# EAGLE design sch (EAGLE 9.5.2)
Piny PA13(SWCLK) i PA14(SWDIO) mają być na odwrót (tak samo ich podłączenie)
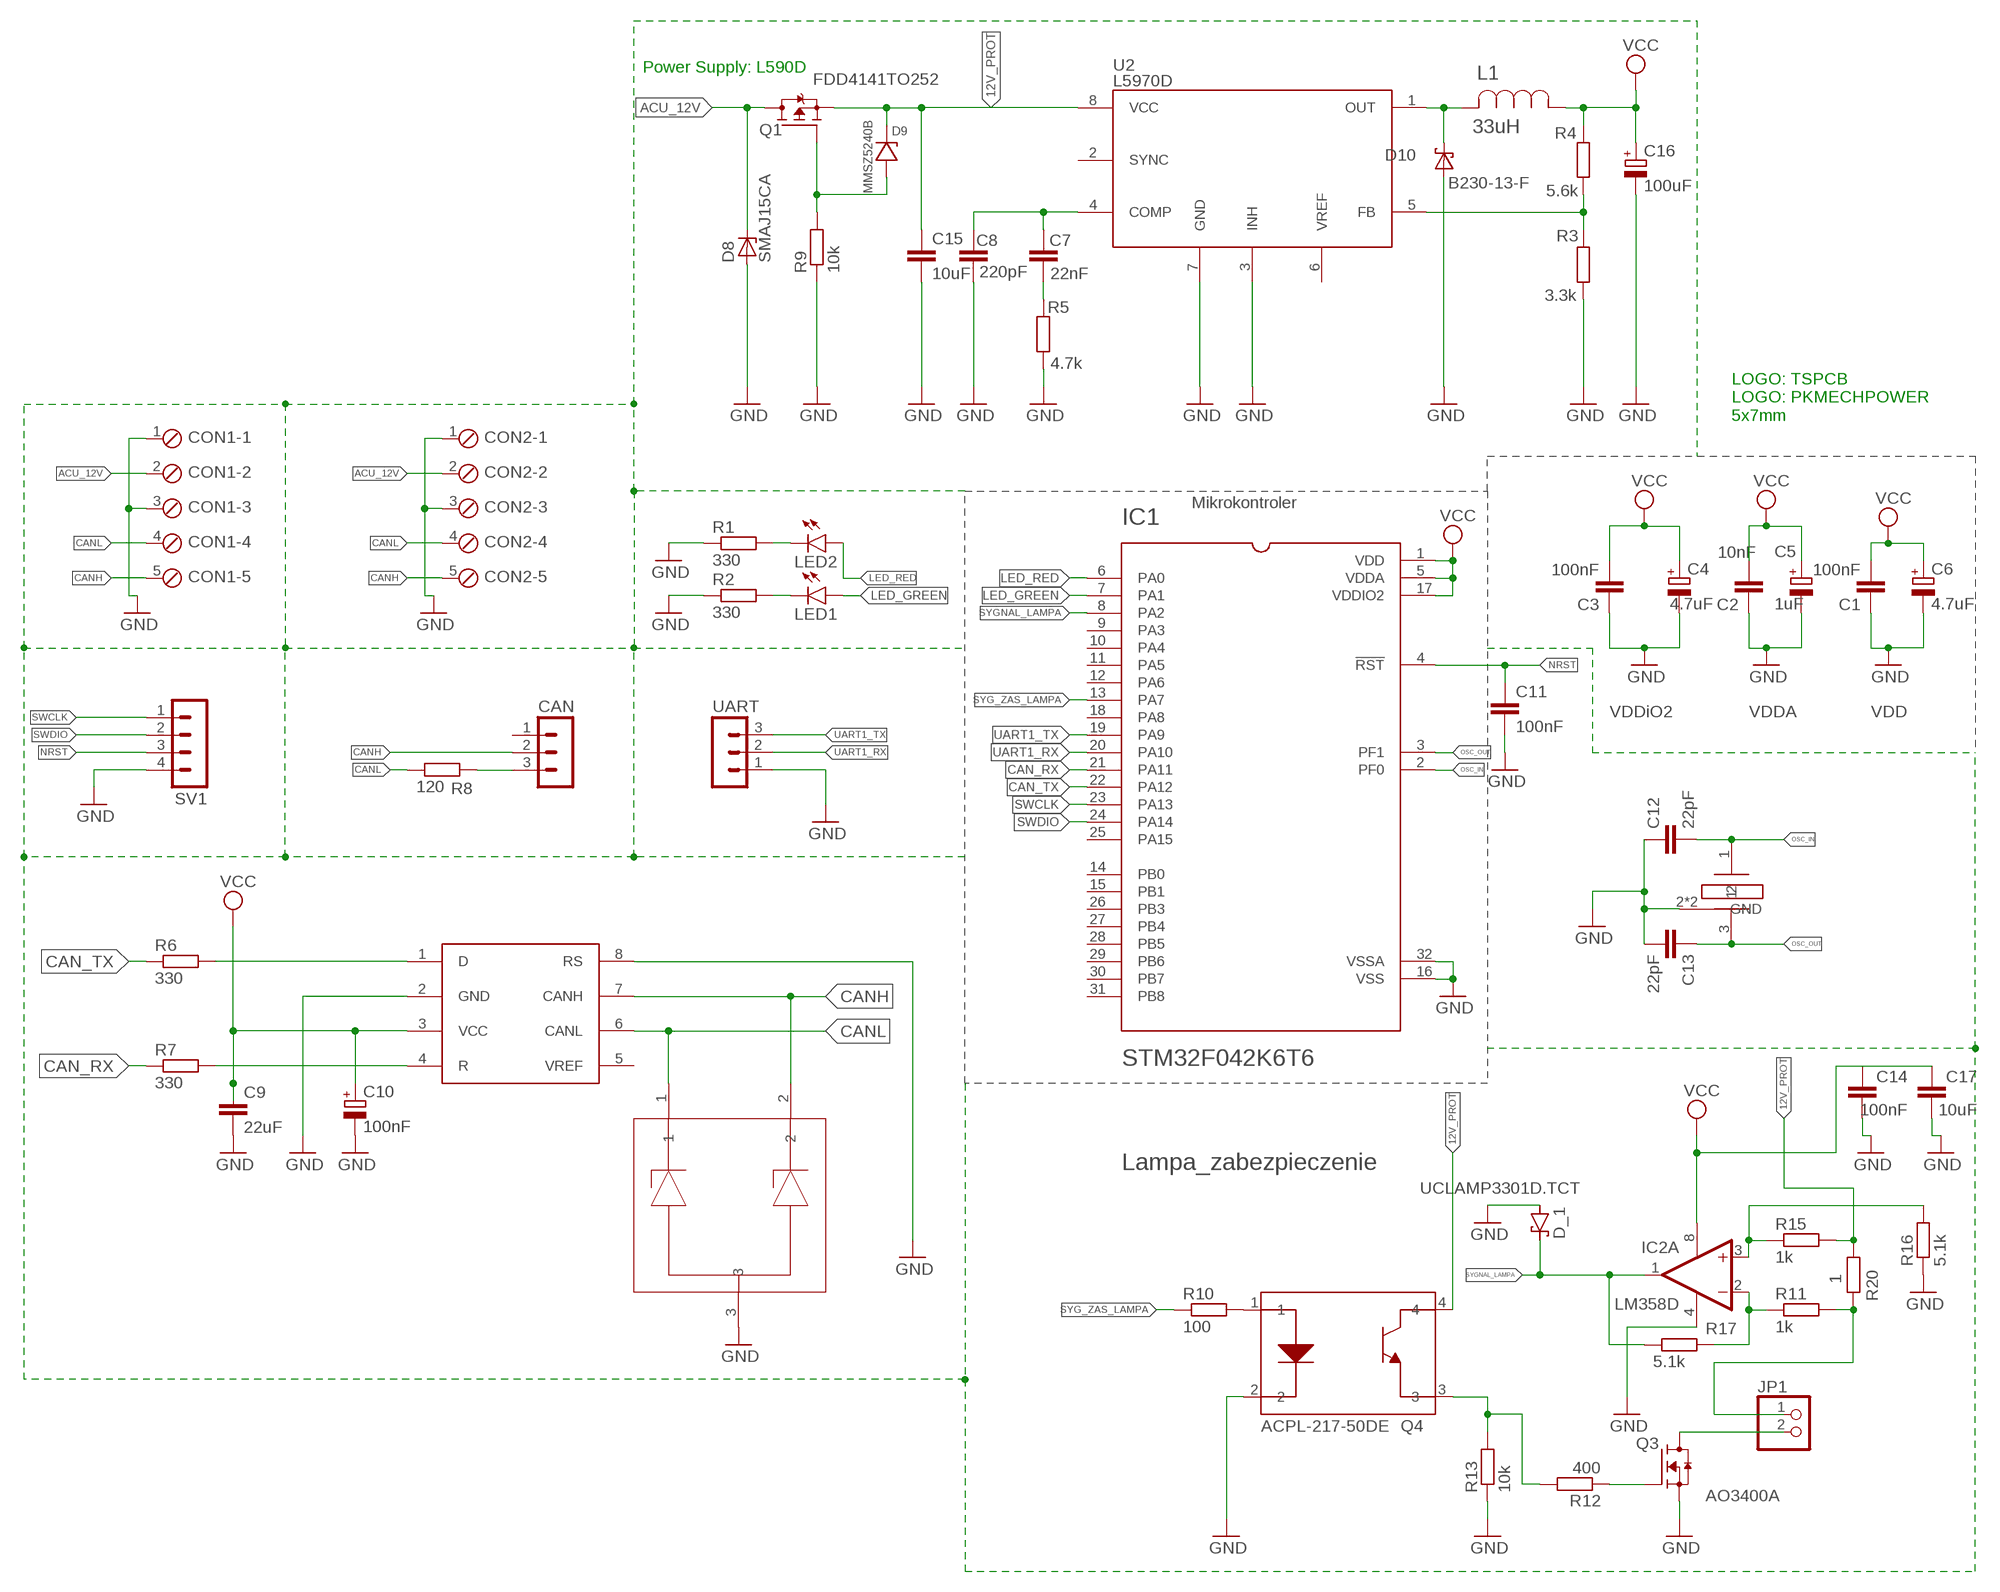
[diagram p0: schematic, sheet 1]

## Parts
C1  100nF  C-EUC0805  [C0805]
C2  10nF  C-EUC0805  [C0805]
C3  100nF  C-EUC0805  [C0805]
C4  4.7uF  CPOL-EUSMCC  [SMC_C]
C5  1uF  CPOL-EUSMCC  [SMC_C]
C6  4.7uF  CPOL-EUSMCC  [SMC_C]
C7  22nF  C-EUC0805  [C0805]
C8  220pF  C-EUC0805  [C0805]
C9  22uF  C-EUC0805  [C0805]
C10  100nF  CPOL-EUSMCC  [SMC_C]
C11  100nF  C-EUC0805  [C0805]
C12  22pF  C-EUC0805  [C0805]
C13  22pF  C-EUC0805  [C0805]
C14  100nF  C-EUC0805  [C0805]
C15  10uF  C-EUC1210  [C1210]
C16  100uF  CPOL-EUSMCD  [SMC_D]
C17  10uF  C-EUC0805  [C0805]
CAN  MA03-1  [MA03-1]
CON1  MPT5  [5POL254]
CON2  MPT5  [5POL254]
D8  SMAJ15CA  [SMA]
D9  MMSZ5240B  ZENER_01  [SOD123]
D10  B230-13-F  [SMB]
D_1  UCLAMP3301D.TCT  [SOD323]
IC1  STM32F042K6T6  [QFP80P900X900X160-32N]
IC2  LM358D  [SO08]
JP1  PINHD-1X2  [1X02]
L1  33uH  DR125-680-R  [INDM125125X600N]
LED1  LEDCHIP-LED0805  [CHIP-LED0805]
LED2  LEDCHIP-LED0805  [CHIP-LED0805]
Q1  FDD4141TO252  [TO252]
Q3  AO3400A  [SOT95P280X125-3N]
Q4  ACPL-217-50DE  [SOIC127P700X220-4N]
R1  330  R-EU_R0805  [R0805]
R2  330  R-EU_R0805  [R0805]
R3  3.3k  R-EU_R0805  [R0805]
R4  5.6k  R-EU_R0805  [R0805]
R5  4.7k  R-EU_R0805  [R0805]
R6  330  R-EU_M0805  [M0805]
R7  330  R-EU_M0805  [M0805]
R8  120  R-EU_M0805  [M0805]
R9  10k  R-EU_R0805  [R0805]
R10  100  R-EU_M0805  [M0805]
R11  1k  R-EU_M0805  [M0805]
R12  400  R-EU_M0805  [M0805]
R13  10k  R-EU_M0805  [M0805]
R15  1k  R-EU_M0805  [M0805]
R16  5.1k  R-EU_M0805  [M0805]
R17  5.1k  R-EU_M0805  [M0805]
R20  1  R-EU_R2512  [R2512]
SV1  MA04-1  [MA04-1]
U2  L5970D  [SO-8]
U$1  SN65HVD  [SO8]
U$2  PESD3V3S2UT_  [SOT95P230X110-3N]
UART  MA03-1  [MA03-1]
XTAL1  CRYSTAL_SMDXT-324  [XT-324]

## Nets
12V_PROT: C15.1 D9.1 Q1.2(S) Q4.4 R15.2 R20.2 U2.8(VCC)
ACU_12V: CON1.2 CON2.2 D8.1(K) Q1.3(D)
CAN_RX: IC1.21(PA11) R7.1
CAN_TX: IC1.22(PA12) R6.1
CANH: CAN.2 CON1.5 CON2.5 U$1.7(CANH) U$2.2
CANL: CON1.4 CON2.4 R8.1 U$1.6(CANL) U$2.1
GND: C1.1 C2.1 C3.1 C4.- C5.- C6.- C8.1 C9.2 C10.- C11.2 C12.1 C13.2 C14.1 C15.2 C16.- C17.1 CON1.1 CON1.3 CON2.1 CON2.3 D8.2(A) D10.2(A) D_1.1(A) IC1.16(VSS) IC1.32(VSSA) IC2.4(P:V-) Q3.2(S) Q4.2 R1.1 R2.1 R3.1 R5.1 R9.1 R13.1 R16.1 SV1.4 U2.3(INH) U2.7(GND) U$1.2(GND) U$1.8(RS) U$2.3 UART.1 XTAL1.2(GND) XTAL1.4(GND)
LED_GREEN: IC1.7(PA1) LED1.A
LED_RED: IC1.6(PA0) LED2.A
N$1: R6.2 U$1.1(D)
N$2: R7.2 U$1.4(R)
N$3: LED2.C R1.2
N$4: LED1.C R2.2
N$5: JP1.2 Q3.3(D)
N$6: CAN.3 R8.2
N$7: D9.2 Q1.1(G) R9.2
N$9: IC2.3(A:+IN) R15.1 R16.2
N$10: Q4.1 R10.2
N$11: Q3.1(G) R12.1
N$13: D10.1(K) L1.2 U2.1(OUT)
N$14: Q4.3 R12.2 R13.2
N$15: R3.2 R4.1 U2.5(FB)
N$16: IC2.2(A:-IN) R11.1 R17.2
N$17: JP1.1 R11.2 R20.1
N$20: C7.2 C8.2 U2.4(COMP)
N$22: C7.1 R5.2
NRST: C11.1 IC1.4(!RST) SV1.3
OSC_IN: C12.2 IC1.2(PF0) XTAL1.1
OSC_OUT: C13.1 IC1.3(PF1) XTAL1.3
SWCLK: IC1.23(PA13) SV1.1
SWDIO: IC1.24(PA14) SV1.2
SYG_ZAS_LAMPA: IC1.13(PA7) R10.1
SYGNAL_LAMPA: D_1.2(C) IC1.8(PA2) IC2.1(A:OUT) R17.1
UART1_RX: IC1.20(PA10) UART.2
UART1_TX: IC1.19(PA9) UART.3
VCC: C1.2 C2.2 C3.2 C4.+ C5.+ C6.+ C9.1 C10.+ C14.2 C16.+ C17.2 IC1.1(VDD) IC1.5(VDDA) IC1.17(VDDIO2) IC2.8(P:V+) L1.1 R4.2 U$1.3(VCC)
Unconnected: CAN.1 IC1.9(PA3) IC1.10(PA4) IC1.11(PA5) IC1.12(PA6) IC1.14(PB0) IC1.15(PB1) IC1.18(PA8) IC1.25(PA15) IC1.26(PB3) IC1.27(PB4) IC1.28(PB5) IC1.29(PB6) IC1.30(PB7) IC1.31(PB8) IC2.5(B:+IN) IC2.6(B:-IN) IC2.7(B:OUT) U2.2(SYNC) U2.6(VREF) U$1.5(VREF)

## Notes on the sheet
- Power Supply: L590D
- LOGO: TSPCB
  LOGO: PKMECHPOWER
  5x7mm
- Mikrokontroler
- VDDiO2 | VDDA | VDD
- Lampa_zabezpieczenie

## Library data of the parts
C1-C3 C7-C9 C11-C15 C17 = rcl:C-EU: CAPACITOR, European symbol; SPICEPREFIX: C
C4-C6 C10 C16 = rcl:CPOL-EU: POLARIZED CAPACITOR, European symbol; SPICEPREFIX: C
CAN UART = con-lstb:MA03-1: PIN HEADER; OC_FARNELL: unknown; OC_NEWARK: unknown
CON1 CON2 = con-phoenix-254:MPT5: PHOENIX CONNECTOR; OC_FARNELL: unknown; OC_NEWARK: unknown
D8 = _SMAJ15CA:SMAJ15CA: Ultra low capacitance unidirectional ElectroStatic Discharge (ESD) protection diode in a SOD523 (SC-79) ultra small and flat lead Surface-Mounted Device (SMD) plastic package designed to protect one signal line from the damage caused by ESD and other transients. AAL Eindhoven MK; AVAILABILITY: Unavailable; DESCRIPTION: DIODE, ESD, LOW CAPACITANCE, SOD523; Diode Type: ESD Protection; Diode Case Style: SOD-523; No. of Pins: 2; MF: Nexperia USA; MP: PESD5V0X1UB; PACKAGE: SOD-523 NXP Semiconductors; PRICE: None
D9 = aLib_diode:ZENER_01
D10 = _B230-13-F:B230-13-F
D_1 = sp4020_10:UCLAMP3301D.TCT
IC1 = _STM32F042K6T6:STM32F042K6T6: Entry-level ARM Cortex-M0 MCU with 32 Kbytes Flash, 48 MHz CPU, USB, CAN and CEC functions; AVAILABILITY: Unavailable; DESCRIPTION: Entry-level ARM Cortex-M0 MCU with 32 Kbytes Flash, 48 MHz CPU, USB, CAN and CEC functions; MF: STMicroelectronics; MP: STM32F042K6T6; PACKAGE: LQFP-32 STMicroelectronics; PRICE: None
IC2 = LM358:LM358: OP AMP
JP1 = pinhead:PINHD-1X2: PIN HEADER
L1 = _DE1205-33:DR125-680-R: POWER INDUCTOR; AVAILABILITY: Unavailable; MF: Coilcraft; MP: DR125-680-R; PACKAGE: Nonstandard Coilcraft; PRICE: None
LED1 LED2 = led:LED: LED OSRAM: - CHIPLED LG R971, LG N971, LY N971, LG Q971, LY Q971, LO R971, LY R971 LH N974, LH R974 LS Q976, LO Q976, LY Q976 LO Q996 - Hyper CHIPLED LW Q18S LB Q993, LB Q99A, LB R99A - SideLED LS A670, LO A670, LY A670, LG A670, LP A670 LB A673, LV A673, LT A673, LW A673 LH A674 LY A675 LS A676, LA A676, LO A676, LY A676, LW A676 LS A679, LY A679, LG A679 - Hyper Micro SIDELED® LS Y876, LA Y876, LO Y876, LY Y876 LT Y87S - SmartLED LW L88C, LW L88S LB L89C, LB L89S, LG L890 LS L89K, LO L89K, LY L89K LS L896, LA L896, LO L896, LY L896 - TOPLED LS T670, LO T670, LY T670, LG T670, LP T670 LSG T670, LSP T670, LSY T670, LOP T670, LYG T670 LG T671, LOG T671, LSG T671 LB T673, LV T673, LT T673, LW T673 LH T674 LS T676, LA T676, LO T676, LY T676, LB T676, LH T676, LSB T676, LW T676 LB T67C, LV T67C, LT T67C, LS T67K, LO T67K, LY T67K, LW E67C LS E67B, LA E67B, LO E67B, LY E67B, LB E67C, LV E67C, LT E67C LW T67C LS T679, LY T679, LG T679 LS T770, LO T770, LY T770, LG T770, LP T770 LB T773, LV T773, LT T773, LW T773 LH T774 LS E675, LA E675, LY E675, LS T675 LS T776, LA T776, LO T776, LY T776, LB T776 LHGB T686 LT T68C, LB T68C - Hyper Mini TOPLED® LB M676 - Mini TOPLED Santana® LG M470 LS M47K, LO M47K, LY M47K Source: http://www.osram.convergy.de LUXEON: - LUMILED® LXK2-PW12-R00, LXK2-PW12-S00, LXK2-PW14-U00, LXK2-PW14-V00 LXK2-PM12-R00, LXK2-PM12-S00, LXK2-PM14-U00 LXK2-PE12-Q00, LXK2-PE12-R00, LXK2-PE12-S00, LXK2-PE14-T00, LXK2-PE14-U00 LXK2-PB12-K00, LXK2-PB12-L00, LXK2-PB12-M00, LXK2-PB14-N00, LXK2-PB14-P00, LXK2-PB14-Q00 LXK2-PR12-L00, LXK2-PR12-M00, LXK2-PR14-Q00, LXK2-PR14-R00 LXK2-PD12-Q00, LXK2-PD12-R00, LXK2-PD12-S00 LXK2-PH12-R00, LXK2-PH12-S00 LXK2-PL12-P00, LXK2-PL12-Q00, LXK2-PL12-R00 Source: www.luxeon.com KINGBRIGHT: KA-3528ASYC Source: www.kingbright.com
Q1 = transistor-fet:FDD4141: P-Channel PowerTrench® MOSFET Source: FDD4141.pdf
Q3 = AO3400A:AO3400A: Trans MOSFET N-CH 30V 5.7A 3-Pin SOT-23; ARROW_ELECTRONICS-PURCHASE-URL: https://snapeda.com/shop?store=Arrow+Electronics&id=405248; AVAILABILITY: Unavailable; DESCRIPTION: N-Channel 30V 5.7A (Ta) 1.4W (Ta) Surface Mount SOT-23-3L; DIGIKEY-PURCHASE-URL: https://snapeda.com/shop?store=DigiKey&id=405248; MF: Alpha &; MP: AO3400A; PACKAGE: SOT-23 Alpha &amp; Omega Semiconductor; PRICE: None
Q4 = _ACPL-217-50DE:ACPL-217-50DE: OPTOISOLATOR 3KV TRANSISTOR 4-SO; AVAILABILITY: Unavailable; DESCRIPTION: Transistor Output Optocouplers 3000Vrms 50% CTR; MF: Broadcom / Avago; MOUSER-PURCHASE-URL: https://snapeda.com/shop?store=Mouser&id=4793791; MP: ACPL-217-50DE; PACKAGE: None; PRICE: None
R1-R13 R15-R17 R20 = rcl:R-EU_: RESISTOR, European symbol; SPICEPREFIX: R
SV1 = con-lstb:MA04-1: PIN HEADER; OC_FARNELL: unknown; OC_NEWARK: unknown
U2 = _L5970D:L5970D; AVAILABILITY: Unavailable; DESCRIPTION: L5970D Series 36 V 1 A Step Down Monolithic Power Switching Regulator - SOIC-8; MF: STMicroelectronics; MP: L5970D; PACKAGE: SOIC-8 STMicroelectronics; PRICE: None
U$1 = SN65HVD230:SN65HVD
U$2 = _PESD3V3S2UT:PESD3V3S2UT_
XTAL1 = _crystals:CRYSTAL_SMD

## Board
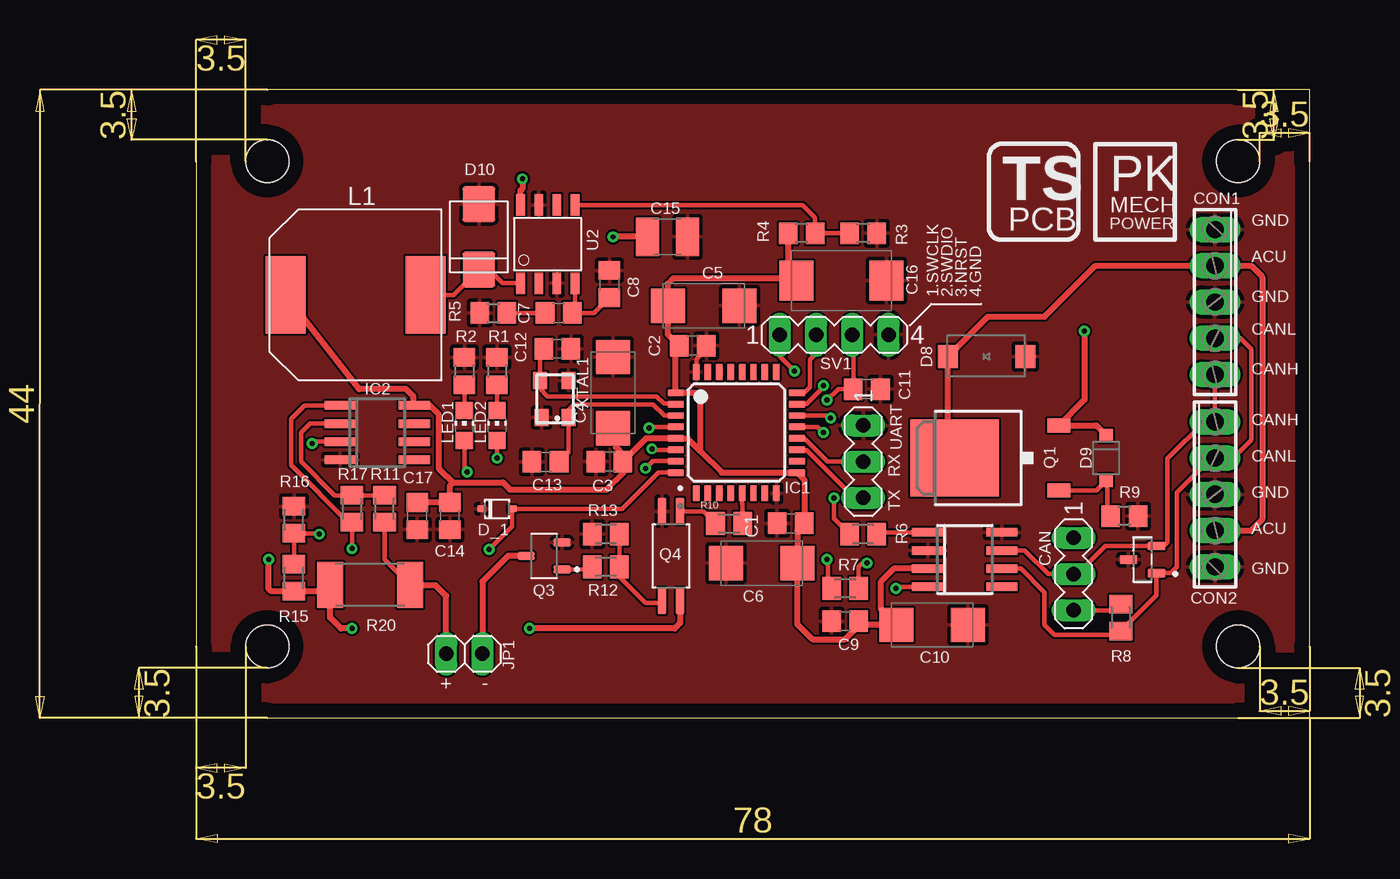
[diagram p1: board, top side]
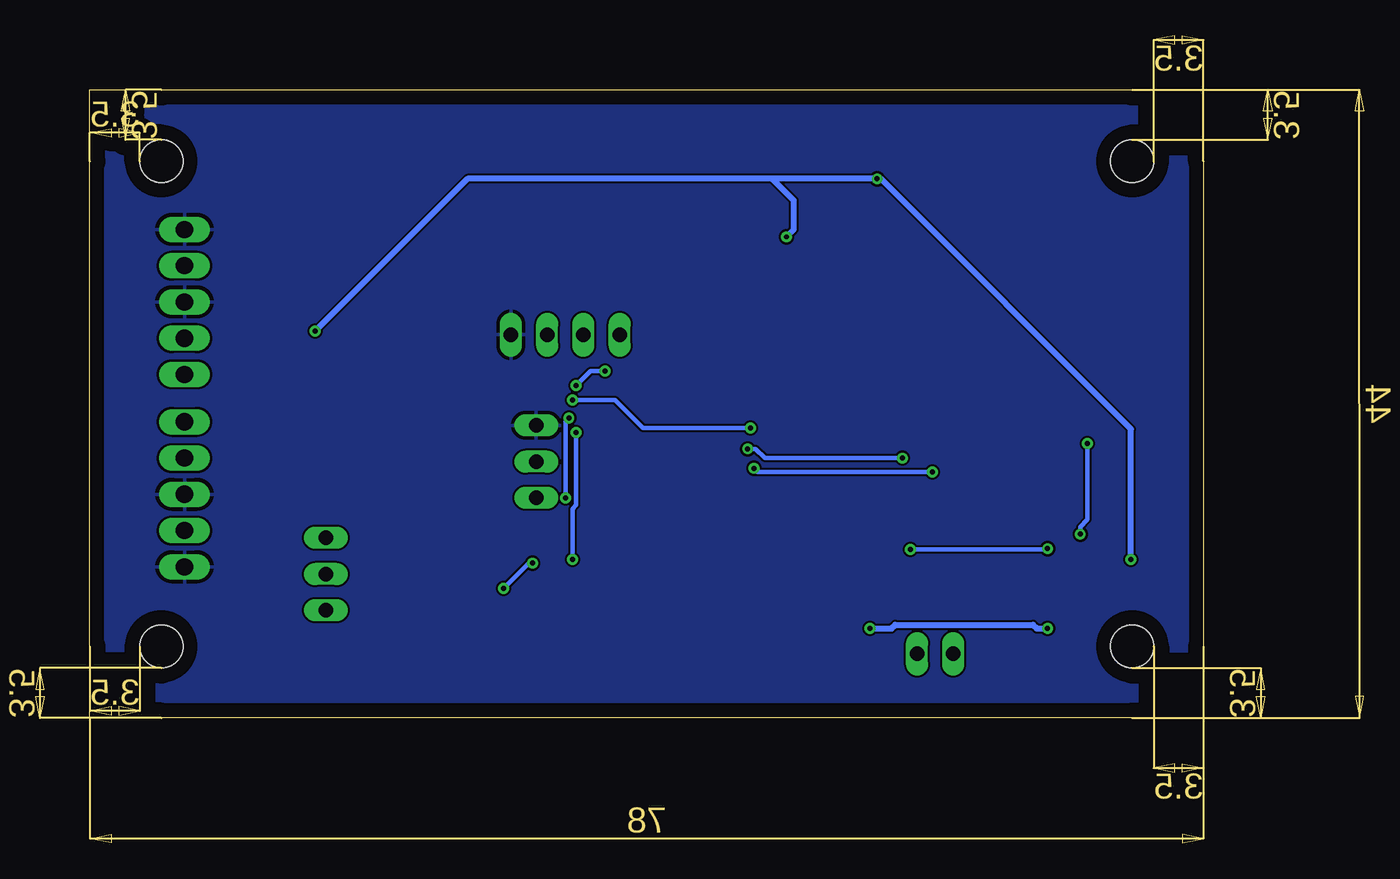
[diagram p2: board, bottom side, seen from below]

Size 78 x 44 mm. Coordinates in mm from the lower left corner, seen from the top.
Outline: 0,0 78,0 78,44 0,44 0,0
Copper layers (1*16): Top 0.035mm / dielectric 1.5mm / Bottom 0.035mm
Design rules "default *": minimum track width 12mil, minimum drill 0.35mm, track to track 6mil, track to pad 6mil, pad to pad 6mil, via to via 6mil, smd to smd 6mil, copper to edge 40mil, drill to drill 6mil, minimum pad ring 10mil, minimum via ring 8mil, stop-mask expansion 4mil, vias tented up to drill 0mil, thermal gap 10mil
Holes 3 mm at 5,5.02 5,39.02 73,39.02 73,5.02

### Footprints (pad centres in the part's own frame; a part is rotated, then mirrored left to right if it is on the bottom)
C0805 = smd 1.3 x 1.5: 1 -0.95,0; 2 0.95,0
SMC_C = smd 2.4 x 2.4: + -2.5,0; - 2.5,0
C1210 = smd 1.6 x 2.7: 1 -1.4,0; 2 1.4,0
SMC_D = smd 2.4 x 2.8: + -3.15,0; - 3.15,0
MA03-1 = drill 1.016 long: 1 -2.54,0; 2 0,0; 3 2.54,0
5POL254 = drill 1.2 long: 1 -5.08,0; 2 -2.54,0; 3 0,0; 4 2.54,0; 5 5.08,0
SMA = smd 1.4 x 1.64: 1 2.715,0; 2 -2.715,0
SOD123 = smd 0.95 x 0.9: 1 0,1.575; 2 0,-1.575
SMB = smd 2.5 x 2.3: 1 -2.3,0; 2 2.3,0
SOD323 = smd 0.6 x 0.45: 1 -1.06,0; 2 1.06,0
QFP80P900X900X160-32N = smd 1.1 x 0.45: 1 -4.25,2.8; 2 -4.25,2; 3 -4.25,1.2; 4 -4.25,0.4; 5 -4.25,-0.4; 6 -4.25,-1.2; 7 -4.25,-2; 8 -4.25,-2.8; 17 4.25,-2.8; 18 4.25,-2; 19 4.25,-1.2; 20 4.25,-0.4; 21 4.25,0.4; 22 4.25,1.2; 23 4.25,2; 24 4.25,2.8 | smd 0.45 x 1.1: 9 -2.8,-4.25; 10 -2,-4.25; 11 -1.2,-4.25; 12 -0.4,-4.25; 13 0.4,-4.25; 14 1.2,-4.25; 15 2,-4.25; 16 2.8,-4.25; 25 2.8,4.25; 26 2,4.25; 27 1.2,4.25; 28 0.4,4.25; 29 -0.4,4.25; 30 -1.2,4.25; 31 -2,4.25; 32 -2.8,4.25
SO08 = smd 0.6 x 2.2: 1 -1.905,-2.6; 2 -0.635,-2.6; 3 0.635,-2.6; 4 1.905,-2.6; 5 1.905,2.6; 6 0.635,2.6; 7 -0.635,2.6; 8 -1.905,2.6
1X02 = drill 1.016 long: 1 -1.27,0; 2 1.27,0
INDM125125X600N = smd 2.8 x 5.4: 1 -4.9,0; 2 4.9,0
CHIP-LED0805 = smd 1.2 x 1.2: A 0,-1.05; C 0,1.05
TO252 = smd 1 x 1.6: 1 -2.28,-4.8; 2 2.28,-4.8 | smd 5.4 x 6.2: 3 0,2.5
SOT95P280X125-3N = smd 1.21 x 0.59: 1 -1.255,0.95; 2 -1.255,-0.95; 3 1.255,0
SOIC127P700X220-4N = smd 1.85 x 0.59: 1 -3.13,0.635; 2 -3.13,-0.635; 3 3.13,-0.635; 4 3.13,0.635
R0805 = smd 1.3 x 1.5: 1 -0.95,0; 2 0.95,0
M0805 = smd 1.3 x 1.6: 1 -0.95,0; 2 0.95,0
R2512 = smd 1.8 x 3.2: 1 -2.8,0; 2 2.8,0
MA04-1 = drill 1.016 long: 1 -3.81,0; 2 -1.27,0; 3 1.27,0; 4 3.81,0
SO-8 = smd 1.524 x 0.61: 1 -2.743,1.905; 2 -2.743,0.635; 3 -2.743,-0.635; 4 -2.743,-1.905; 5 2.743,-1.905; 6 2.743,-0.635; 7 2.743,0.635; 8 2.743,1.905
SO8 = smd 0.6 x 2.2: 1 -4.445,-6.41; 2 -3.175,-6.41; 3 -1.905,-6.41; 4 -0.635,-6.41; 5 -0.635,-1.21; 6 -1.905,-1.21; 7 -3.175,-1.21; 8 -4.445,-1.21
SOT95P230X110-3N = smd 1.26 x 0.59: 1 -0.98,0.95; 2 -0.98,-0.95; 3 0.98,0
XT-324 = smd 1.2 x 1: 1 1.301,1.016; 2 -1.299,0.916; 3 -1.299,-0.984; 4 1.301,-0.984

### Placement (x,y rotation side)
C1  41.66,13.64 0 top
C2  34.8,26.09 180 top
C3  28.96,17.97 0 top
C4  29.21,22.79 90 top
C5  35.56,28.88 0 top
C6  39.63,10.85 180 top
C7  25.4,28.37 0 top
C8  28.96,30.4 270 top
C9  45.47,6.78 180 top
C10  51.57,6.53 0 top
C11  46.99,23.04 0 top
C12  25.31,25.86 180 top
C13  24.48,17.94 180 top
C14  17.78,14.15 90 top
C15  33.02,33.71 0 top
C16  45.22,30.66 0 top
C17  15.5,14.15 90 top
CAN  61.47,10.08 270 top
CON1  71.38,29.14 270 top
CON2  71.38,15.67 90 top
D8  55.38,25.32 180 top
D9  63.76,18.21 0 top
D10  19.82,33.71 90 top
D_1  21.09,14.66 0 top
IC1  37.85,19.99 0 top
IC2  12.7,19.99 270 top
JP1  18.8,4.5 0 top
L1  11.18,29.64 0 top
LED1  18.8,20.5 0 top
LED2  21.09,20.5 0 top
Q1  55.63,18.21 90 top
Q3  24.39,11.35 180 top
Q4  33.28,11.35 270 top
R1  21.09,24.31 270 top
R2  18.8,24.31 270 top
R3  46.74,33.96 180 top
R4  42.42,33.96 180 top
R5  20.83,28.37 0 top
R6  46.74,12.88 0 top
R7  45.47,9.07 0 top
R8  64.77,7.04 90 top
R9  65.03,14.15 180 top
R10  37.34,13.64 180 top
R11  13.21,14.66 270 top
R12  28.71,10.59 0 top
R13  28.71,12.88 0 top
R15  6.86,9.82 270 top
R16  6.86,13.89 270 top
R17  10.93,14.66 90 top
R20  12.2,9.32 180 top
SV1  44.71,26.85 0 top
U2  24.64,33.2 90 top
U$1  57.66,8.56 270 top
U$2  66.3,11.1 180 top
UART  46.74,17.96 270 top
XTAL1  25.12,22.35 90 top

### Tracks (layer width: path | path; a pad name or v marks a point on that pad's centre or on a via)
12V_PROT  (via drill 0.35)
  Top 0.406: D9.1 63.05,20.49 Q1.2 62.23,22.3 v62.23,27.1 | Q4.4 33.91,6.66 33.53,6.27 v23.37,6.27 | v5.08,11.1 5.08,9.07 5.28,8.87 R15.2 8.95,8.87 R20.2 9.4,7.04 10.16,6.27 v10.93,6.27 | v22.86,37.77 22.86,37.08 22.74,36.96 U2.8 | C15.1 v29.21,33.71
  Bottom 0.406: v5.08,11.1 5.08,20.24 22.61,37.77 v22.86,37.77 30.23,37.77 | 30.23,37.77 51.57,37.77 v62.23,27.1 | v29.21,33.71 28.71,34.21 28.71,36.25 30.23,37.77 | v23.37,6.27 21.85,6.27 21.59,6.53 11.94,6.53 11.69,6.27 v10.93,6.27
ACU_12V
  Top 0.406: CON2.2 73.92,13.13 74.68,13.89 74.68,30.92 73.92,31.68 CON1.2 63,31.68 59.44,28.12 55.45,28.12 D8.1 52.66,18.68 Q1.3
CAN_RX  (via drill 0.35)
  Top 0.305: R7.1 44.27,9.32 44.27,11.03 v44.2,11.1 | v43.95,19.99 43.55,20.39 IC1.21
  Bottom 0.305: v44.2,11.1 44.2,14.66 43.95,14.91 v43.95,19.99
CAN_TX  (via drill 0.35)
  Top 0.305: R6.1 44.69,13.98 v44.69,15.42 | v44.45,21.01 44.27,21.19 IC1.22
  Bottom 0.305: v44.69,15.42 44.69,20.77 v44.45,21.01
CANH
  Top 0.305: CON1.5 CON2.5 70.62,20.75 68.04,18.18 68.04,12.3 67.79,12.05 U$2.2 63.69,12.05 61.73,10.08 CAN.2 59.69,10.08 58.04,11.73 U$1.7
CANL
  Top 0.305: CON1.4 73.15,26.6 73.92,25.83 73.92,19.48 72.65,18.21 CON2.4 71.12,18.21 68.72,15.81 68.72,10.58 68.29,10.15 U$2.1 67.28,8.59 R8.1 64.52,5.83 60.14,5.83 59.44,6.53 59.44,8.81 57.79,10.47 U$1.6
GND
  Top 0.305: C2.1 35.75,25.83 35.05,25.13 IC1.32
  pour Top: 0.01,0 0.01,44 78,44 78,0
  pour Bottom: 0.01,0 0.01,44 78,44 78,0
LED_GREEN  (via drill 0.35)
  Top 0.305: LED1.A 18.8,17.44 v19,17.24 | v31.5,17.49 32,17.99 IC1.7
  Bottom 0.305: v31.5,17.49 31.25,17.24 v19,17.24
LED_RED  (via drill 0.35)
  Top 0.305: LED2.A v21.09,18.2 | v31.93,18.86 31.99,18.79 IC1.6
  Bottom 0.305: v21.09,18.2 30.73,18.2 31.38,18.86 v31.93,18.86
N$1
  Top 0.305: R6.2 47.82,13.01 U$1.1
N$2  (via drill 0.35)
  Top 0.305: R7.2 46.42,10.59 46.67,10.85 v46.99,10.85 | v49.03,9.07 49.15,9.2 U$1.4
  Bottom 0.305: v46.99,10.85 47.25,10.85 v49.03,9.07
N$3
  Top 0.305: R1.2 LED2.C
N$4
  Top 0.305: R2.2 LED1.C
N$5
  Top 0.406: Q3.3 21.86,11.35 20.07,9.56 JP1.2
N$6
  Top 0.305: R8.2 64.33,7.54 CAN.3
N$7
  Top 0.305: R9.2 63.82,14.4 63.82,16.57 D9.2 63.05,15.93 Q1.1
N$9  (via drill 0.35)
  Top 0.305: R15.1 R16.2 8.58,12.94 v8.64,12.88 | v8.13,19.23 8.26,19.35 IC2.3
  Bottom 0.305: v8.13,19.23 8.13,13.89 8.64,13.39 v8.64,12.88
N$10
  Top 0.305: Q4.1 35.55,14.48 R10.2
N$11
  Top 0.305: R12.1 27.57,10.4 Q3.1
N$13
  Top 0.305: U2.1 21.47,30.45 20.52,31.41 D10.1 18.05,29.64 L1.2
N$14
  Top 0.305: R13.2 R12.2 29.66,9.9 31.5,8.05 32.47,8.05 Q4.3
N$15
  Top 0.305: R3.2 R4.1 43.37,35.04 42.47,35.94 U2.5
N$16
  Top 0.305: R11.1 R17.2 9.72,15.61 7.37,17.96 7.37,19.99 8.01,20.62 IC2.2
N$17
  Top 0.305: R20.1 13.21,11.11 R11.2
  Top 0.406: JP1.1 17.53,8.56 16.77,9.32 R20.1
N$20
  Top 0.305: C8.2 27.88,28.37 C7.2 26.55,28.56 U2.4
N$22
  Top 0.305: R5.2 C7.1
NRST  (via drill 0.35)
  Top 0.305: v44.2,22.28 44.99,23.04 C11.1 46.04,26.78 SV1.3 | v31.74,20.32 31.76,20.32 31.82,20.39 IC1.4
  Bottom 0.305: v44.2,22.28 41.22,22.28 39.27,20.32 v31.74,20.32
OSC_IN
  Top 0.305: IC1.2 33.57,22.02 32.77,22.02 32.26,22.53 24.64,22.53 24.1,23.07 XTAL1.1 24.1,25.61 C12.2
OSC_OUT
  Top 0.305: C13.1 26.1,18.61 XTAL1.3 26.1,21.58 26.5,21.98 32.02,21.98 32.81,21.19 IC1.3
SWCLK  (via drill 0.35)
  Top 0.305: IC1.23 42.76,21.99 43.95,23.18 v43.95,23.29 | v41.91,24.31 40.9,25.32 SV1.1
  Bottom 0.305: v43.95,23.29 42.93,24.31 v41.91,24.31
SWDIO
  Top 0.305: SV1.2 43.44,25.53 43.01,25.1 43.01,23.19 42.61,22.79 IC1.24
SYG_ZAS_LAMPA
  Top 0.305: R10.1 38.29,14.98 38.25,15.02 IC1.13
SYGNAL_LAMPA  (via drill 0.35)
  Top 0.305: IC1.8 32.4,17.2 29.86,14.66 D_1.2 22.15,13.43 v20.53,11.82 | v10.93,11.86 R17.1 10.67,13.71 6.66,17.72 6.66,20.94 7.61,21.9 IC2.1
  Bottom 0.305: v20.53,11.82 10.97,11.82 v10.93,11.86
UART1_RX
  Top 0.305: IC1.20 42.61,19.59 44.24,17.96 UART.2
UART1_TX
  Top 0.305: UART.3 46.13,15.42 42.76,18.79 IC1.19
VCC
  Top 0.406: 35.31,18.72 35.31,22.53 35.05,22.79 IC1.1 33.6,25.83 C2.2 33.06,26.87 C5.+ 33.06,30.44 33.43,30.81 41.91,30.81 | 35.31,18.72 36.84,17.19 IC1.17 42.61,16.68 C1.2 42.13,13.16 C6.+ 42.13,6.57 43.18,5.51 45.47,5.51 46.23,6.27 46.23,6.53 46.49,6.53 46.49,6.72 | 35.31,18.72 34.44,19.59 IC1.5 31.53,19.59 C3.2 | C17.2 C14.2 17.78,16.28 18,16.5 | C3.2 29.91,18.47 29.41,18.97 29.41,20.1 C4.+ | C3.2 29.98,17.97 29.98,17.2 28.77,16 22,16 21.5,16.5 18,16.5 | U$1.3 48.9,10.47 47.99,9.55 47.99,7.61 C10.+ 46.67,6.53 46.49,6.72 | C9.1 46.49,6.72 | L1.1 11.43,23.04 14.74,23.04 15.24,22.53 15.24,21.95 IC2.8 16.39,21.9 17.02,21.26 17.02,17.45 17.53,16.94 17.56,16.94 18,16.5 | R4.2 41.47,31.25 41.91,30.81 | 41.91,30.81 C16.+

### Text on the board
tPlace: PK | TS | MECH | PCB | POWER | 1.SWCLK | 2.SWDIO | 3.NRST | 4.GND | RX | TX | + | -
tNames: GND | ACU | GND | CANL | CANH | CANH | CANL | GND | ACU | GND